# EAGLE design Combine-CPU-POWER-RELAY-pth (EAGLE 7.6.0)
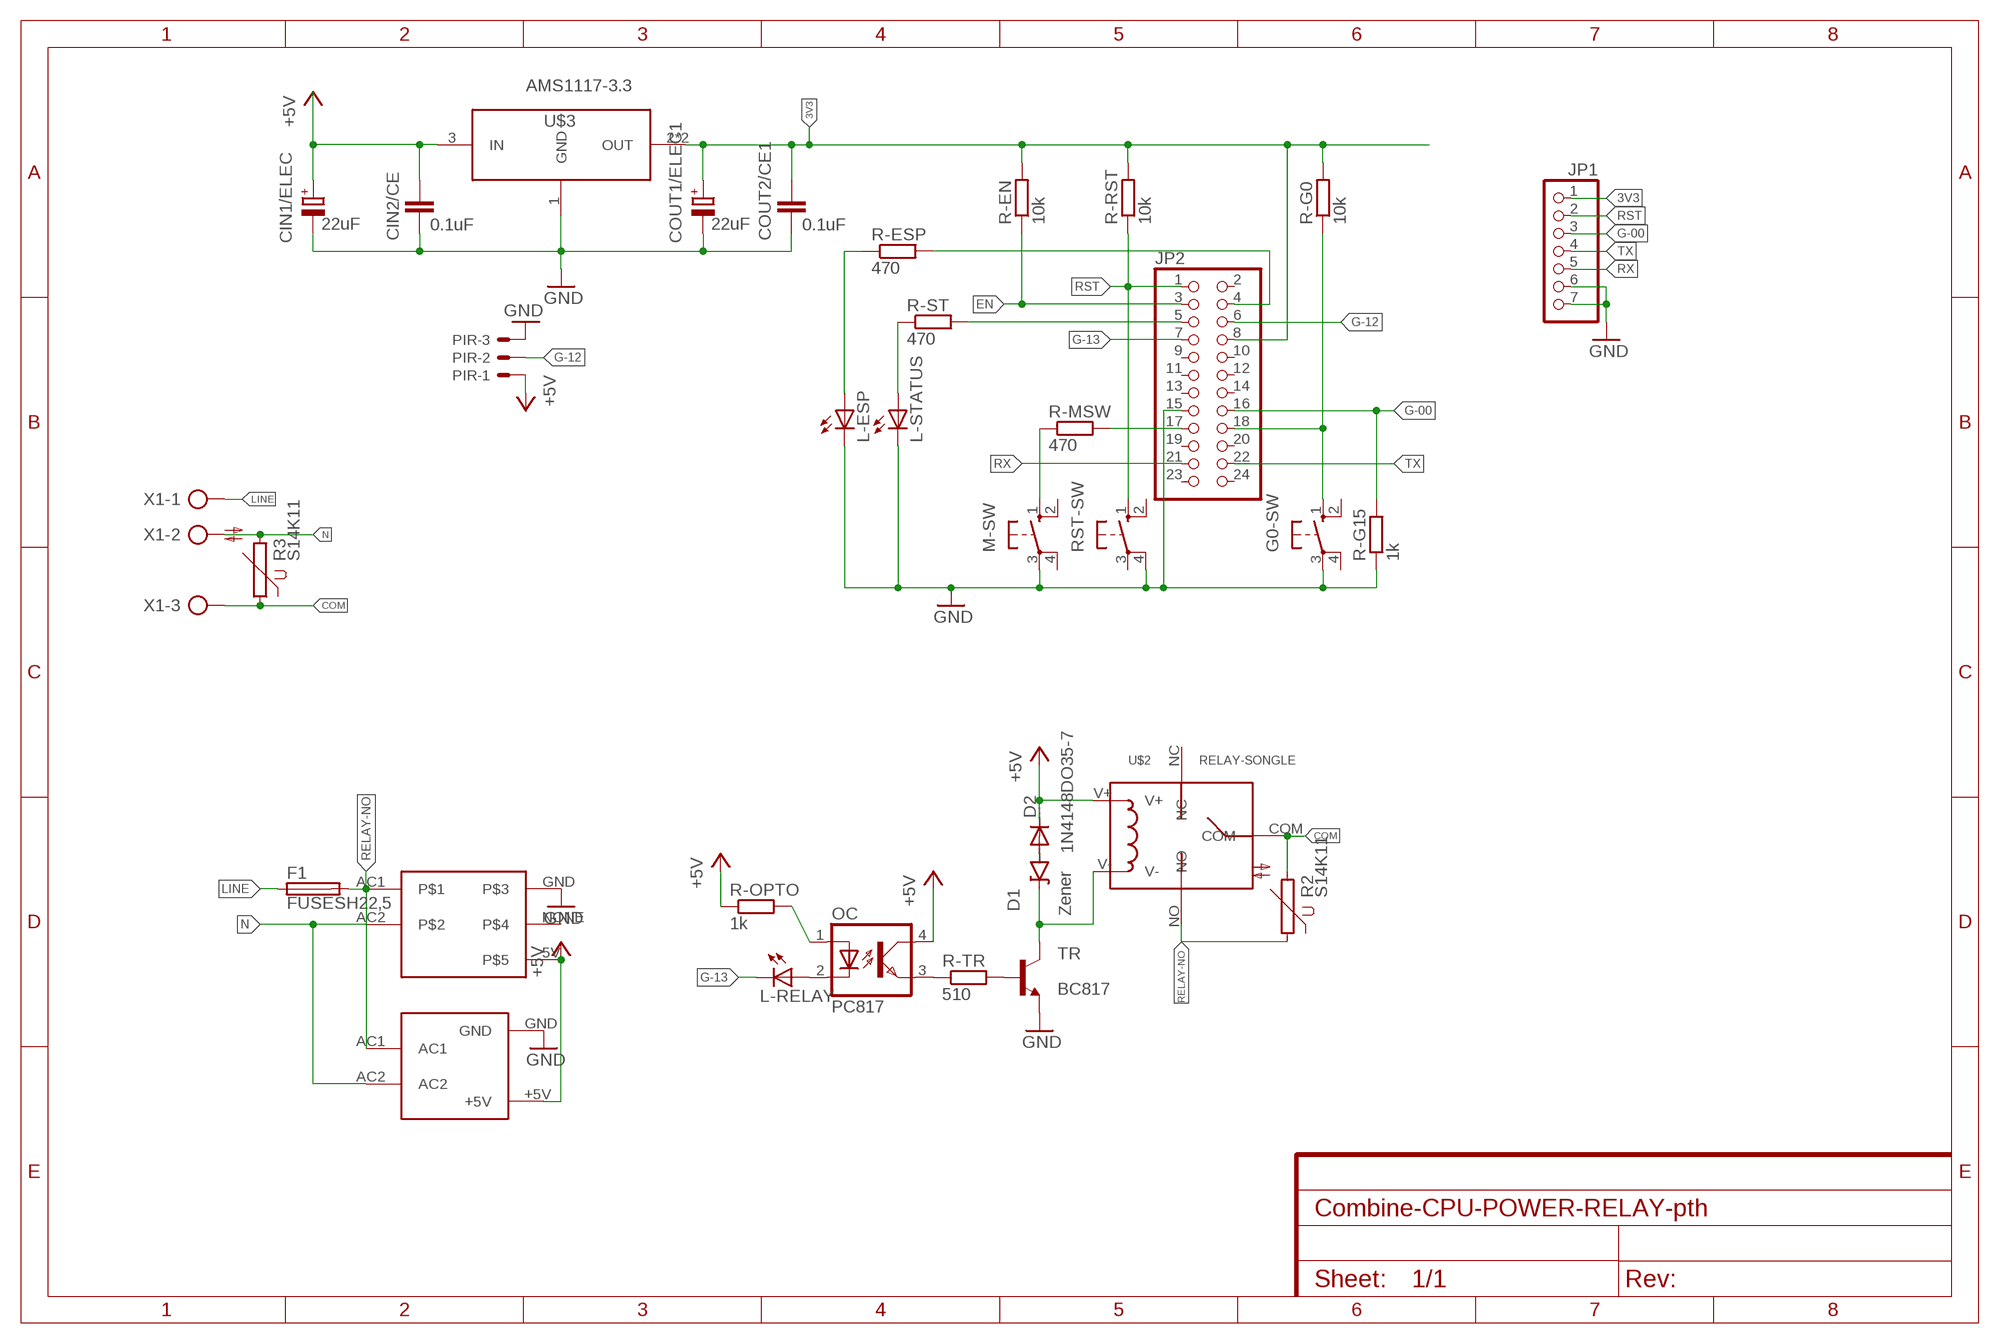
[diagram p0: schematic, sheet 1]

## Parts
CIN1/ELEC  22uF  CPOL-EUE2.5-5  [E2,5-5]
CIN2/CE  0.1uF  C-EU050-024X044  [C050-024X044]
COUT1/ELEC1  22uF  CPOL-EUE2.5-5  [E2,5-5]
COUT2/CE1  0.1uF  C-EU050-024X044  [C050-024X044]
D1  Zener  DIODE-ZENERPTH  [DIODE-ZENER]
D2  1N4148DO35-7  [DO35-7]
F1  FUSESH22,5  [SH22,5]
G0-SW  10-XX  [B3F-10XX]
JP1  PINHD-1X7  [1X07]
JP2  PINHD-2X12  [2X12]
L-ESP  LED3MM  [LED3MM]
L-RELAY  LED3MM  [LED3MM]
L-STATUS  LED3MM  [LED3MM]
M-SW  10-XX  [B3F-10XX]
OC  PC817  [DIL04]
PIR  53048-03  [53048-03]
R2  S14K11  [S14K11]
R3  S14K11  [S14K11]
R-EN  10k  R-EU_0207/2V  [0207/2V]
R-ESP  470  R-EU_0207/2V  [0207/2V]
R-G0  10k  R-EU_0207/2V  [0207/2V]
R-G15  1k  R-EU_0207/2V  [0207/2V]
R-MSW  470  R-EU_0207/2V  [0207/2V]
R-OPTO  1k  R-EU_0207/2V  [0207/2V]
R-RST  10k  R-EU_0207/2V  [0207/2V]
R-ST  470  R-EU_0207/2V  [0207/2V]
R-TR  510  R-EU_0207/2V  [0207/2V]
RST-SW  10-XX  [B3F-10XX]
TR  BC817  BC817-16SMD  [SOT23-BEC]
U$1  HLK-PM01  [HLK-PM01]
U$2  RELAY-SONGLE  [RELAY-SONGLE]
U$3  AMS1117-3.3  [SOT-223]
U$4  POWERSUPPLY-5V-700MA  [POWERSUPPLY-5V-700MA]
X1  AK300/3  [AK300/3]

## Nets
3V3: COUT1/ELEC1.+ COUT2/CE1.1 JP1.1 JP2.8 R-EN.2 R-G0.2 R-RST.2 U$3.2(OUT) U$3.4(OUT)
+5V: CIN1/ELEC.+ CIN2/CE.1 D2.C OC.4(COL) PIR.1 R-OPTO.1 U$1.+5V U$2.V+ U$3.3(IN) U$4.5V
COM: R2.2 R3.1 U$2.COM X1.3
EN: JP2.3 R-EN.1
G-00: JP1.3 JP2.16 R-G15.2
G-12: JP2.6 PIR.2
G-13: JP2.7 L-RELAY.K(C)
GND: CIN1/ELEC.- CIN2/CE.2 COUT1/ELEC1.- COUT2/CE1.2 G0-SW.3(P) JP1.6 JP1.7 JP2.15 L-ESP.K(C) L-STATUS.K(C) M-SW.3(P) PIR.3 R-G15.1 RST-SW.4(P1) TR.E U$1.GND U$3.1(GND) U$4.GND
LINE: F1.1 X1.1
N: R3.2 U$1.AC2 U$4.AC2 X1.2
N$1: OC.3(EMIT) R-TR.1
N$2: R-TR.2 TR.B
N$4: D1.P$2(A) D2.A
N$7: JP2.17 R-MSW.2
N$8: JP2.5 R-ST.2
N$13: OC.1(A) R-OPTO.2
N$17: D1.P$1(C) TR.C U$2.V-
N$19: JP2.4 R-ESP.2
N$23: L-RELAY.A OC.2(C)
N$24: M-SW.1(S) R-MSW.1
N$25: L-STATUS.A R-ST.1
N$26: L-ESP.A R-ESP.1
N$27: G0-SW.1(S) JP2.18 R-G0.1
RELAY-NO: F1.2 R2.1 U$1.AC1 U$2.NO U$4.AC1
RST: JP1.2 JP2.1 R-RST.1 RST-SW.1(S)
RX: JP1.5 JP2.21
TX: JP1.4 JP2.22
Unconnected: G0-SW.2(S1) G0-SW.4(P1) JP2.2 JP2.9 JP2.10 JP2.11 JP2.12 JP2.13 JP2.14 JP2.19 JP2.20 JP2.23 JP2.24 M-SW.2(S1) M-SW.4(P1) RST-SW.2(S1) RST-SW.3(P) U$2.NC U$4.NONE

## Library data of the parts
CIN1/ELEC COUT1/ELEC1 = rcl:CPOL-EU: POLARIZED CAPACITOR, European symbol
CIN2/CE COUT2/CE1 = rcl:C-EU: CAPACITOR, European symbol
D1 = SparkFun-DiscreteSemi:DIODE-ZENER: Zener Diode Production Part - 8199 3.4V Zener Voltage
D2 = diode:1N4148: DIODE high speed (Philips)
F1 = fuse:FUSE: Fuse; OC_FARNELL: unknown; OC_NEWARK: unknown
G0-SW M-SW RST-SW = switch-omron:10-XX: OMRON SWITCH; MPN: B3F-1000; OC_FARNELL: 176432; OC_NEWARK: 36M3542
JP1 = pinhead:PINHD-1X7: PIN HEADER
JP2 = pinhead:PINHD-2X12: PIN HEADER
L-ESP L-RELAY L-STATUS = led:LED: LED OSRAM: - CHIPLED LG R971, LG N971, LY N971, LG Q971, LY Q971, LO R971, LY R971 LH N974, LH R974 LS Q976, LO Q976, LY Q976 LO Q996 - Hyper CHIPLED LW Q18S LB Q993, LB Q99A, LB R99A - SideLED LS A670, LO A670, LY A670, LG A670, LP A670 LB A673, LV A673, LT A673, LW A673 LH A674 LY A675 LS A676, LA A676, LO A676, LY A676, LW A676 LS A679, LY A679, LG A679 - Hyper Micro SIDELED® LS Y876, LA Y876, LO Y876, LY Y876 LT Y87S - SmartLED LW L88C, LW L88S LB L89C, LB L89S, LG L890 LS L89K, LO L89K, LY L89K LS L896, LA L896, LO L896, LY L896 - TOPLED LS T670, LO T670, LY T670, LG T670, LP T670 LSG T670, LSP T670, LSY T670, LOP T670, LYG T670 LG T671, LOG T671, LSG T671 LB T673, LV T673, LT T673, LW T673 LH T674 LS T676, LA T676, LO T676, LY T676, LB T676, LH T676, LSB T676, LW T676 LB T67C, LV T67C, LT T67C, LS T67K, LO T67K, LY T67K, LW E67C LS E67B, LA E67B, LO E67B, LY E67B, LB E67C, LV E67C, LT E67C LW T67C LS T679, LY T679, LG T679 LS T770, LO T770, LY T770, LG T770, LP T770 LB T773, LV T773, LT T773, LW T773 LH T774 LS E675, LA E675, LY E675, LS T675 LS T776, LA T776, LO T776, LY T776, LB T776 LHGB T686 LT T68C, LB T68C - Hyper Mini TOPLED® LB M676 - Mini TOPLED Santana® LG M470 LS M47K, LO M47K, LY M47K Source: http://www.osram.convergy.de LUXEON: - LUMILED® LXK2-PW12-R00, LXK2-PW12-S00, LXK2-PW14-U00, LXK2-PW14-V00 LXK2-PM12-R00, LXK2-PM12-S00, LXK2-PM14-U00 LXK2-PE12-Q00, LXK2-PE12-R00, LXK2-PE12-S00, LXK2-PE14-T00, LXK2-PE14-U00 LXK2-PB12-K00, LXK2-PB12-L00, LXK2-PB12-M00, LXK2-PB14-N00, LXK2-PB14-P00, LXK2-PB14-Q00 LXK2-PR12-L00, LXK2-PR12-M00, LXK2-PR14-Q00, LXK2-PR14-R00 LXK2-PD12-Q00, LXK2-PD12-R00, LXK2-PD12-S00 LXK2-PH12-R00, LXK2-PH12-S00 LXK2-PL12-P00, LXK2-PL12-Q00, LXK2-PL12-R00 Source: www.luxeon.com KINGBRIGHT: KA-3528ASYC Source: www.kingbright.com
OC = optocoupler:PC817: SHARP OPTO COUPLER; MPN: PC817X4J000F; OC_FARNELL: 9707727; OC_NEWARK: 97K7059
PIR = con-molex:53?-03: CONNECTOR wire to board 1.25 mm (.049 inch) pitch header; MF: WALDOM/MOLEX; MPN: 53048-0310; OC_FARNELL: 9732918; OC_NEWARK: 38C9908
R2 R3 = varistor:S14K11: VARISTOR
R-EN R-ESP R-G0 R-G15 R-MSW R-OPTO R-RST R-ST R-TR = rcl:R-EU_: RESISTOR, European symbol
TR = transistor-npn:BC817*: NPN Transistor
U$1 = HLK-PM01:HLK-PM01
U$2 = Seeed-OPL-Relay:RELAY-SONGLE
U$3 = AMS1117-3.3:AMS1117-3.3: 1A LOW DROPOUT VOLTAGE REGULATOR
U$4 = PowerSupply-5V-700mA:POWERSUPPLY-5V-700MA
X1 = con-ptr500:AK300/3: CONNECTOR; OC_FARNELL: unknown; OC_NEWARK: unknown

## Net classes
0 default: width 0.305 mm

## Board
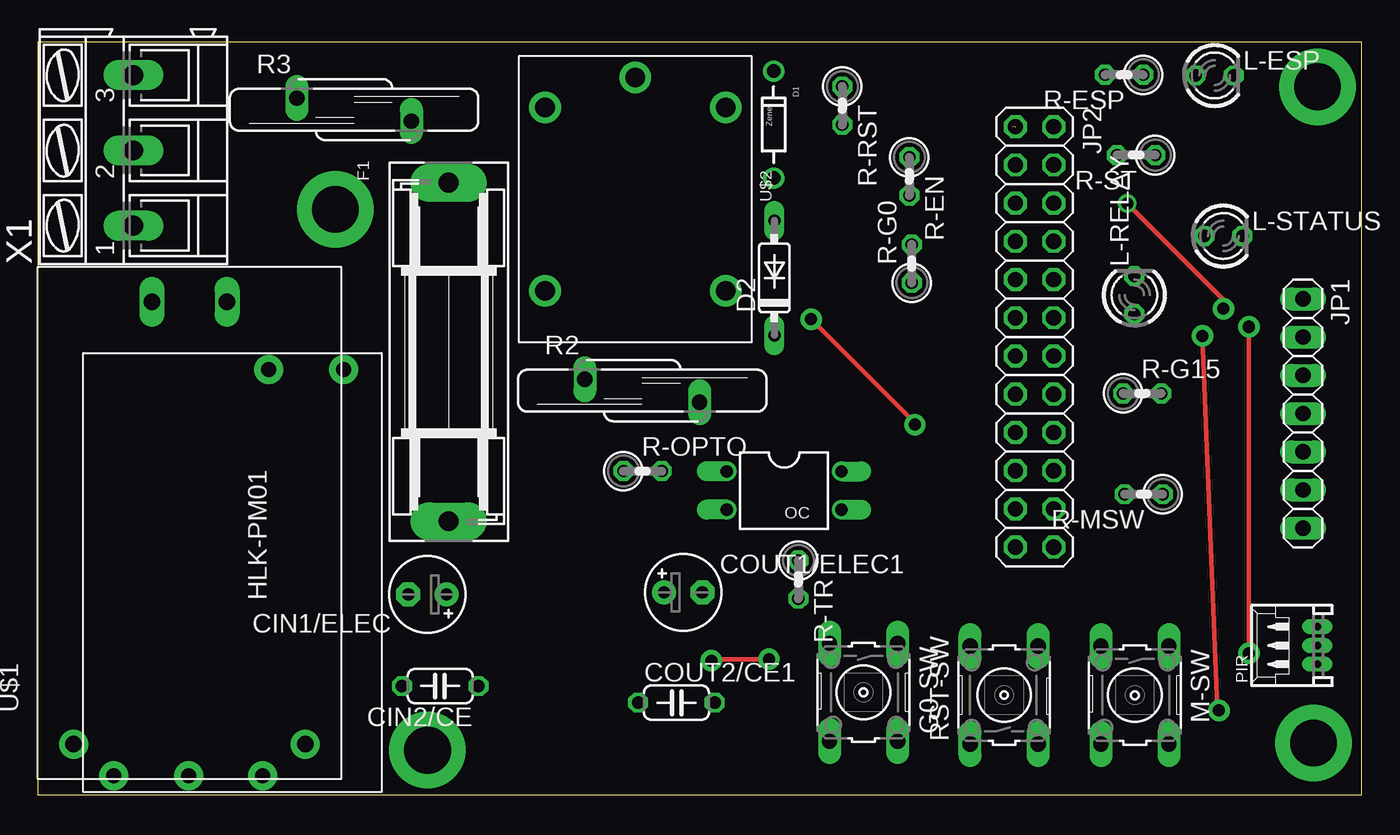
[diagram p1: board, top side]
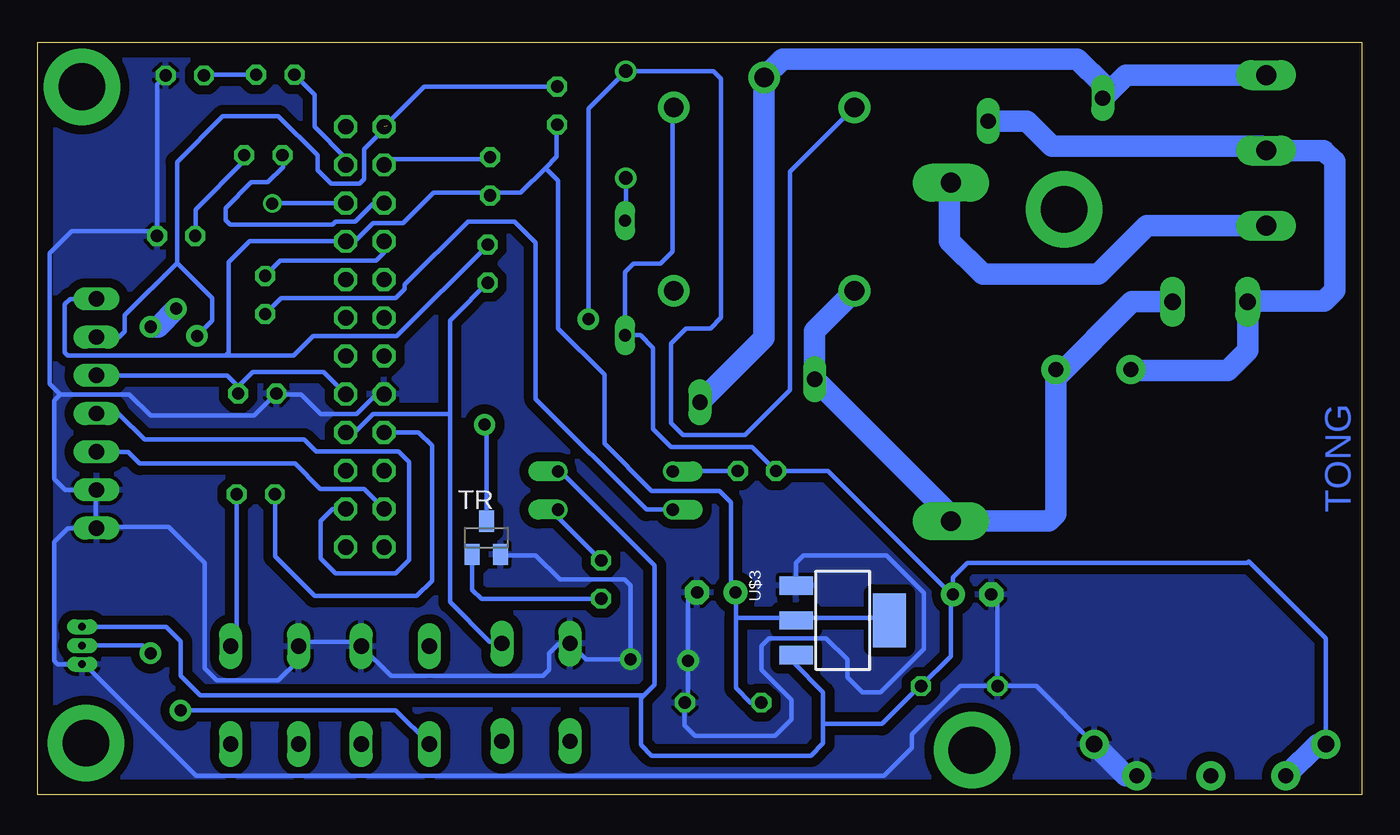
[diagram p2: board, bottom side, seen from below]

Size 88 x 50 mm. Coordinates in mm from the lower left corner, seen from the top.
Outline: 0,0 88,0 88,50 0,50 0,0
Copper layers (1*16): Top 0.035mm / dielectric 1.5mm / Bottom 0.035mm
Design rules "default": minimum track width 10mil, minimum drill 24mil, track to track 8mil, track to pad 8mil, pad to pad 8mil, via to via 8mil, smd to smd 8mil, copper to edge 40mil, drill to drill 8mil, minimum pad ring 10mil, minimum via ring 8mil, stop-mask expansion 4mil, vias tented up to drill 0mil, thermal gap 10mil

### Footprints (pad centres in the part's own frame; a part is rotated, then mirrored left to right if it is on the bottom)
E2,5-5 = drill 0.813 pad 1.6: + -1.27,0 | drill 0.813 pad 1.6 octagon: - 1.27,0
C050-024X044 = drill 0.813 octagon: 1 -2.54,0; 2 2.54,0
DIODE-ZENER = drill 0.9: P$1 -3.556,0; P$2 3.556,0
DO35-7 = drill 0.813 long: A 3.81,0; C -3.81,0
SH22,5 = drill 1.321 pad 2.54 long: 1 -11.252,0; 2 11.252,0
B3F-10XX = drill 1.016 long: 1 -3.251,2.261; 2 3.251,2.261; 3 -3.251,-2.261; 4 3.251,-2.261
1X07 = drill 1.016 long: 1 -7.62,0; 2 -5.08,0; 3 -2.54,0; 4 0,0; 5 2.54,0; 6 5.08,0; 7 7.62,0
2X12 = drill 1.016 octagon: 1 -13.97,-1.27; 2 -13.97,1.27; 3 -11.43,-1.27; 4 -11.43,1.27; 5 -8.89,-1.27; 6 -8.89,1.27; 7 -6.35,-1.27; 8 -6.35,1.27; 9 -3.81,-1.27; 10 -3.81,1.27; 11 -1.27,-1.27; 12 -1.27,1.27; 13 1.27,-1.27; 14 1.27,1.27; 15 3.81,-1.27; 16 3.81,1.27; 17 6.35,-1.27; 18 6.35,1.27; 19 8.89,-1.27; 20 8.89,1.27; 21 11.43,-1.27; 22 11.43,1.27; 23 13.97,-1.27; 24 13.97,1.27
LED3MM = drill 0.813 octagon: A -1.27,0; K 1.27,0
DIL04 = drill 0.813 offset: 1 -1.27,-3.81; 2 1.27,-3.81; 3 1.27,3.81; 4 -1.27,3.81
53048-03 = drill 0.5 pad 0.698 long: 1 1.25,-1.25; 2 0,-1.25; 3 -1.25,-1.25
S14K11 = drill 1.016 long: 1 -0.762,-3.81; 2 0.762,3.81
0207/2V = drill 0.813 octagon: 1 -1.27,0; 2 1.27,0
SOT23-BEC = smd 1 x 1.4: B -0.95,-1.1; C 0,1.1; E 0.95,-1.1
HLK-PM01 = drill 1.1 pad 1.93: +5V 15.19,-7.76; GND 15.19,7.64 | drill 1.1 long: AC1 -14.21,2.44; AC2 -14.21,-2.56
RELAY-SONGLE = drill 1.3 pad 2.1: COM -8.1,0; NC 6.1,6; NO 6.1,-6; V+ -6.1,6; V- -6.1,-6
SOT-223 = smd 1.219 x 2.235: 1 -2.381,-3.099; 2 -0.07,-3.099; 3 2.241,-3.099 | smd 3.6 x 2.2: 4 -0.07,3.099
POWERSUPPLY-5V-700MA = drill 1 pad 1.93: 5V 13.5,-7.9; AC1 -13.5,7.4; AC2 -13.5,2.4; GND 13.5,2; NONE 13.5,-2.9
AK300/3 = drill 1.321 long: 1 -5.004,0; 2 0,0; 3 5.004,0

### Placement (x,y rotation side)
CIN1/ELEC  25.9,13.31 180 top
CIN2/CE  26.75,7.22 180 top
COUT1/ELEC1  42.9,13.44 0 top
COUT2/CE1  42.45,6.12 0 top
D1  48.91,44.54 270 top
D2  48.96,34.35 90 top
F1  27.32,29.43 270 top
G0-SW  54.88,6.8 270 top
JP1  84.08,25.34 270 top
JP2  66.25,30.43 270 top
L-ESP  78.22,47.81 0 top
L-RELAY  72.89,33.21 90 top
L-STATUS  78.79,37.14 0 top
M-SW  72.92,6.62 270 top
OC  49.61,20.22 270 top
PIR  83.79,9.92 90 top
R2  40.18,26.85 270 top
R3  21.03,45.54 270 top
R-EN  57.93,41.1 270 top
R-ESP  72.2,47.85 180 top
R-G0  58.09,35.3 90 top
R-G15  73.4,26.67 0 top
R-MSW  73.5,19.97 180 top
R-OPTO  40.2,21.51 0 top
R-RST  53.47,45.8 270 top
R-ST  73,42.51 180 top
R-TR  50.55,14.3 270 top
RST-SW  64.23,6.62 90 top
TR  58.18,17.08 0 bottom
U$1  10.15,18.55 270 top
U$2  39.72,39.58 270 top
U$3  34.49,11.51 270 bottom
U$4  12.94,14.76 270 top
X1  6.36,42.82 90 top

### Tracks (layer width: path | path; a pad name or v marks a point on that pad's centre or on a via)
3V3
  Bottom 0.305: 41.59,11.75 37.78,11.75 U$3.2 37.47,11.75 31.43,11.75 U$3.4 | 41.59,11.75 41.59,13.34 COUT1/ELEC1.+ 41.91,13.65 41.91,19.41 42.7,20.2 47.2,20.2 50.34,23.34 50.34,27.94 53.4,31 53.4,40.8 54.25,41.65 | 53.66,44.13 53.66,44.45 R-RST.2 53.5,44.5 53.5,42.4 54.25,41.65 | R-G0.2 58.1,36.51 64.14,30.48 64.16,30.5 69.7,30.5 71,29.2 75.5,29.2 | 54.25,41.65 55.9,40.01 57.91,40.01 | COUT2/CE1.1 40.62,6.12 41.6,7.1 41.6,11.74 41.59,11.75 | JP1.1 85.84,32.96 86.2,32.6 86.2,29.4 86,29.2 75.5,29.2 | 75.5,29.2 75.3,29.4 75.3,35.4 73.92,36.78 JP2.8 67.44,36.7 67,36.7 65.7,38 63.7,38 61.7,40.01 57.91,40.01 | R-EN.2 57.91,39.88 57.91,40.01
+5V
  Bottom 0.305: OC.4 53.34,21.59 46.99,15.24 46.99,7.3 47.69,6.6 | U$3.3 37.78,9.21 37.78,8.78 35.8,6.8 35.8,4.6 | U$2.V+ 45.8,45.6 45.8,36.1 46.6,35.3 48.4,35.3 48.96,34.74 D2.C 47.94,30.54 47.1,29.7 47.1,24.3 45.9,23.1 40.52,23.1 R-OPTO.1 35.48,21.51 27.28,13.31 CIN1/ELEC.+ | PIR.1 79.47,11.17 78.5,10.2 78.5,7.9 77.2,6.6 47.69,6.6 | 35.8,4.6 35.8,3.4 36.6,2.6 47.2,2.6 47.9,3.3 47.9,6.39 47.69,6.6 | 35.8,4.6 35.7,4.7 31.9,4.7 29.38,7.22 CIN2/CE.1 27.3,9.21 27.3,13.02 27.17,13.15 CIN1/ELEC.+ | U$1.+5V 2.39,10.39 7.5,15.5 7.6,15.4 26.2,15.4 27.17,14.43 CIN1/ELEC.+
  Bottom 1.422: U$1.+5V 2.94,3.36 U$4.5V
COM
  Bottom 1.422: X1.3 15.69,47.83 R3.1 17.22,47.22 18.9,48.9 38.5,48.9 U$2.COM 39.72,30.36 R2.2
EN
  Bottom 0.305: R-EN.1 58.1,42.23 64.77,42.23 64.77,41.91 JP2.3
G-00
  Bottom 0.305: JP2.16 69,28.1 73.7,28.1 74.67,27.13 | 74.67,27.13 R-G15.2 | 74.67,27.13 75.42,27.88 JP1.3
G-12  (via drill 0.8, 0.8 pad 1.42)
  Top 0.305: v80.5,31.1 v80.5,9.4 | v72.4,39.3 78.8,32.9 v78.8,32.3
  Bottom 0.305: JP2.6 72.38,39.32 v72.4,39.3 | v80.5,9.4 81.02,9.92 PIR.2
  Bottom 1.422: v78.8,32.3 80,31.1 v80.5,31.1
G-13
  Bottom 0.305: JP2.7 64.98,36.02 65.5,35.5 71.87,35.5 L-RELAY.K
GND  (via drill 0.8 pad 1.42)
  Top 0.305: v48.6,9 44.87,9 v44.77,8.9
  Bottom 0.305: COUT1/ELEC1.- 44.45,13.34 44.77,13.02 v44.77,8.9 44.77,6.35 COUT2/CE1.2 45,4.6 44.3,3.9 39,3.9 37.9,5 37.9,6.3 39.9,8.3 39.9,9.9 39.4,10.4 35.6,10.4 34.2,9 34.2,7.8 33.2,6.8 32,6.8 29.1,9.7 29.1,13.4 31.6,15.9 37.1,15.9 37.6,15.4 U$3.1 37.47,13.97 37.33,13.97 | RST-SW.4 66.67,10.16 70.48,10.16 M-SW.3 70.66,8.94 72,7.6 76.1,7.6 76.9,8.4 76.9,15.4 79.3,17.8 84,17.8 JP1.7 | 66.36,9.84 RST-SW.4 | JP1.7 84.14,17.78 84.14,20 JP1.6 86.16,20.26 86.9,21 86.9,26.2 86.5,26.6 | R-G15.1 72.2,26.6 | 72.2,26.6 73.6,25.2 80.5,25.2 81.9,26.6 86.5,26.6 | JP2.15 65.48,26.62 66.8,25.3 69.2,25.3 70.5,26.6 72.2,26.6 | TR.E 57.15,15.9 54.9,15.9 53.3,14.3 49,14.3 48.6,13.9 v48.6,9 51.57,9 G0-SW.3 53.35,10.05 54,9.4 54,8.3 54.4,7.9 64.51,7.9 RST-SW.4 | L-ESP.K 80.06,47.23 L-STATUS.K 80.39,37.47 85.73,37.47 87.2,36 87.2,27.3 86.5,26.6 | JP1.7 84.1,17.7 86,17.7 86.9,16.8 86.9,8.9 86.67,8.67 PIR.3 84.77,8.57 77.47,1.27 31.75,1.27 29.9,3.12 29.9,4 26.68,7.22 CIN2/CE.2 | U$1.GND 21.64,7.22 CIN2/CE.2 | CIN1/ELEC.- 24.21,12.89 CIN2/CE.2
  Bottom 1.422: U$4.GND 15.69,1.26 U$1.GND
  pour Bottom (isolate 0.61): 0,0 88,0 88,50 0,50
LINE
  Bottom 1.422: X1.1 14.28,37.82 17.5,34.6 25.2,34.6 27.4,36.8 27.4,40.6 F1.1
N
  Bottom 1.422: R3.2 22.27,44.77 20.6,43.1 6.64,43.1 X1.2 2.52,42.83 1.8,42.1 1.8,33.5 2.5,32.8 7.55,32.8 U$1.AC2 7.59,29.51 8.9,28.2 15.28,28.2 U$4.AC2
N$1
  Bottom 0.305: R-TR.1 53.42,18.44 OC.3
N$2
  Bottom 0.305: R-TR.2 50.58,13 58.5,13 59.13,13.63 TR.B
N$3  (via drill 3.1 pad 5.08)
  other vias: 25.91,2.95
N$4
  Bottom 0.305: D1.P$2 48.91,38.2 D2.A
N$6  (via drill 3.1 pad 5.08)
  other vias: 84.79,3.43
N$7
  Bottom 0.305: JP2.17 62.68,24.08 61.8,23.2 61.8,14.2 62.8,13.2 69.6,13.2 72.23,15.83 R-MSW.2
N$8
  Bottom 0.305: R-ST.2 71.7,42.48 71.7,41.7 72.7,40.7 73.8,40.7 75.5,39 75.5,38.2 75.2,37.9 68.4,37.9 68.2,38.1 66.9,38.1 65.7,39.3 65,39.3 JP2.5
N$9  (via drill 3.1 pad 5.08)
  other vias: 19.78,38.9
N$13
  Bottom 0.305: R-OPTO.2 45.78,21.51 OC.1
N$17  (via drill 0.8 pad 1.42)
  Top 0.305: v58.3,24.6 58.3,24.7 v51.4,31.6
  Bottom 0.305: TR.C 58.18,24.48 v58.3,24.6 | v51.4,31.6 51.4,45.61 D1.P$1 43.1,48.1 42.6,47.6 42.6,31.7 43.3,31 44.9,31 45.9,30 45.9,24.7 45.1,23.9 41,23.9 38,26.9 38,41.4 U$2.V-
N$18  (via drill 3.1 pad 5.08)
  other vias: 85.05,47.06
N$19
  Bottom 0.305: JP2.4 67.52,42.32 69.6,44.4 69.6,46.52 R-ESP.2
N$23
  Bottom 0.305: OC.2 47.55,18.95 54.9,26.3 54.9,36.7 56.3,38.1 59.4,38.1 63.6,33.9 63.6,33.6 64.2,33 71.83,33 L-RELAY.A
N$24
  Bottom 0.305: M-SW.1 74.77,10.28 R-MSW.1
N$25
  Bottom 0.305: R-ST.1 74.27,42.13 77.5,38.9 77.5,37.16 L-STATUS.A
N$26
  Bottom 0.305: R-ESP.1 76.91,47.85 L-ESP.A
N$27
  Bottom 0.305: 58.1,33.97 R-G0.1 60.3,31.82 60.3,31.8 60.6,31.5 60.6,25.4 | G0-SW.1 57.15,10.16 57.96,10.16 60.6,12.8 60.6,25.4 | JP2.18 66.92,24.08 65.7,25.3 60.7,25.3 60.6,25.4
RELAY-NO
  Bottom 1.422: U$4.AC1 20.34,27.7 | 20.34,27.7 20.34,18.66 20.8,18.2 27.29,18.2 F1.2 27.32,18.56 R2.1 36.37,30.83 U$2.NO | U$1.AC1 15.28,32.76 20.34,27.7
RST  (via drill 0.8 pad 1.42)  (1 unrouted)
  Top 0.305: v78.5,5.6 78.4,5.7 v77.4,30.5
  Bottom 0.305: 78.74,35.34 78.74,42.06 75.7,45.1 72,45.1 69.4,42.5 69.4,41.5 68.5,40.6 66.6,40.6 66.3,40.9 66.3,42.9 64.77,44.43 | RST-SW.1 64.19,5.6 v78.5,5.6 | 78.74,35.34 76.4,33 76.4,31.5 v77.4,30.5 | JP1.2 82.58,30.42 82.2,30.8 82.2,31.88 78.74,35.34 | R-RST.1 62.31,47.07 JP2.1
RX
  Bottom 0.305: JP2.21 66.3,20.32 69.22,20.32 70.9,22 81.2,22 82,22.8 JP1.5
TX
  Bottom 0.305: JP2.22 68.4,19 69.2,18.2 69.2,15.7 68.2,14.7 64.2,14.7 63.3,15.6 63.3,22.1 64,22.8 69.5,22.8 70.3,23.6 80.9,23.6 82.6,25.3 84.05,25.3 JP1.4

### Text on the board
Bottom: TONG